# EAGLE schematic ProximitySwitchRelay (EAGLE 9.1.2)
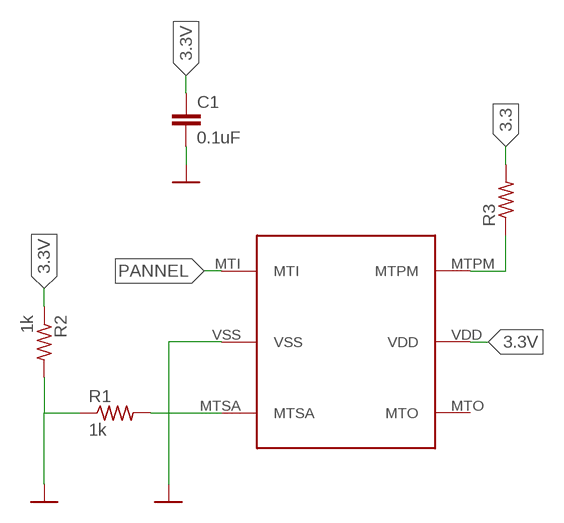
[diagram p0: schematic, sheet 1]

## Parts
C1  0.1uF  0.1UF-KIT-EZ-50V-20%  [CAP-PTH-SMALL-KIT]
R1  1k  RESISTOR_R-US_0204/5  [RESISTOR_0204/5]
R2  1k  RESISTOR_R-US_0204/5  [RESISTOR_0204/5]
R3  RESISTOR_R-US_0204/5  [RESISTOR_0204/5]
U$1  MTCH101  [MTCH101]

## Nets
3.3: R3.2
3.3V: C1.1 R2.1 U$1.VDD
GND: C1.2 R1.1 R2.2 U$1.VSS
N$1: R3.1 U$1.MTPM
N$2: R1.2 U$1.MTSA
PANNEL: U$1.MTI
Unconnected: U$1.MTO

## Library data of the parts
C1 = MMC Eagle:0.1UF: 0.1µF ceramic capacitors A capacitor is a passive two-terminal electrical component used to store electrical energy temporarily in an electric field.; PROD_ID: CAP-08370
R1-R3 = MMC Eagle:RESISTOR_R-US_: RESISTOR, American symbol
U$1 = MMC Eagle:MTCH101